# EAGLE design cg2 (EAGLE 4.16)
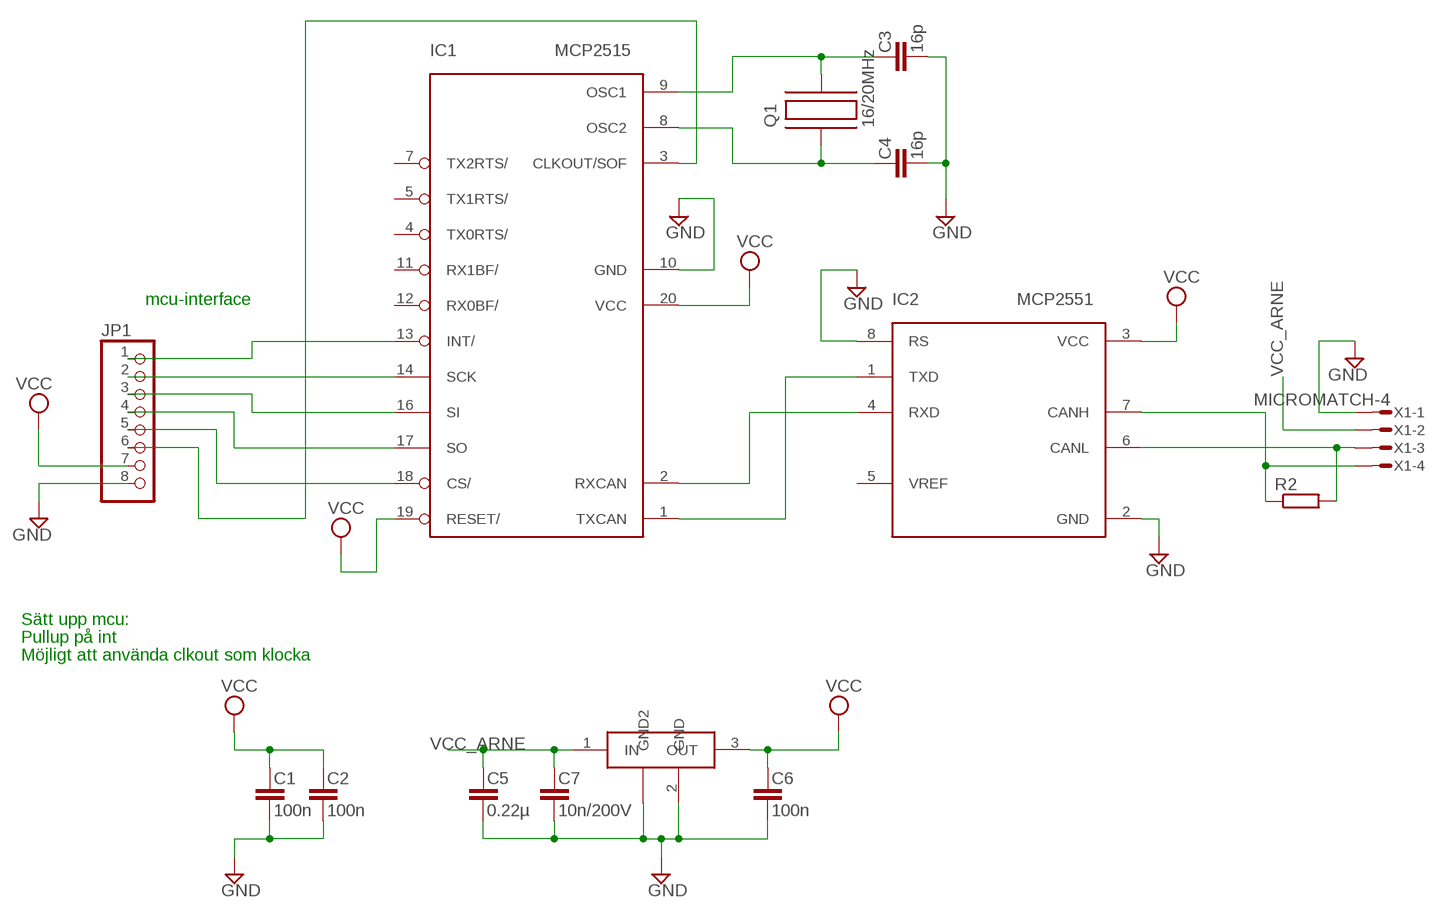
[diagram p0: schematic, sheet 1]

## Parts
C1  100n  C-EU  [C0603]
C2  100n  C-EU  [C0603]
C3  16p  C-EU  [C0603]
C4  16p  C-EU  [C0603]
C5  0.22µ  C-EU  [C0603]
C6  100n  C-EU  [C0603]
C7  10n/200V  C-EU  [C0603]
IC1  MCP2515  [TSSOP]
IC2  MCP2551  [SOIC]
IC3  LM340MP-5.0  [SOT223]
JP1  PINHD-2X04  [2X04]
Q1  16/20MHz  C-MAC-LFA147E  [SMD]
R2  R-EUR0603  [R0603]
X1  MICROMATCH-4  [MICROMATCH-4]

## Nets
CANH: IC2.7(CANH) R2.1 X1.4
CANL: IC2.6(CANL) R2.2 X1.3
CLK: IC1.3(CLKOUT/SOF) JP1.6
CS: IC1.18(CS/) JP1.5
GND: C1.2 C2.2 C3.2 C4.2 C5.2 C6.2 C7.2 IC1.10(GND) IC2.2(GND) IC2.8(RS) IC3.2(GND) IC3.4(GND2) JP1.8 X1.1
INT: IC1.13(INT/) JP1.1
N$1: IC1.2(RXCAN) IC2.4(RXD)
N$2: IC1.1(TXCAN) IC2.1(TXD)
N$12: C3.1 IC1.9(OSC1) Q1.P$2
N$13: C4.1 IC1.8(OSC2) Q1.P$1
SCK: IC1.14(SCK) JP1.2
SI: IC1.16(SI) JP1.3
SO: IC1.17(SO) JP1.4
VCC: C1.1 C2.1 C6.1 IC1.19(RESET/) IC1.20(VCC) IC2.3(VCC) IC3.3(OUT) JP1.7
VCC_ARNE: C5.1 C7.1 IC3.1(IN) X1.2
Unconnected: IC1.4(TX0RTS/) IC1.5(TX1RTS/) IC1.7(TX2RTS/) IC1.11(RX1BF/) IC1.12(RX0BF/) IC2.5(VREF)

## Notes on the sheet
- mcu-interface
- Sätt upp mcu:
- Pullup på int
- Möjligt att använda clkout som klocka

## Library data of the parts
C1-C7 = rcl:C-EU
IC1 = mcp2515:MCP2515
IC2 = mcp2551:MCP2551
IC3 = lm340mp:LM340MP-5.0
JP1 = pinhead-mm:PINHD-2X04
Q1 = hc49-4h-smx:C-MAC-LFA147E
R2 = rcl:R-EU
X1 = con-amp-micromatch:MICROMATCH-4: MicroMaTch 4 7-215464-4 / 0-215464-4 Drawing Number C-215464 DDEController.pdf

## Board
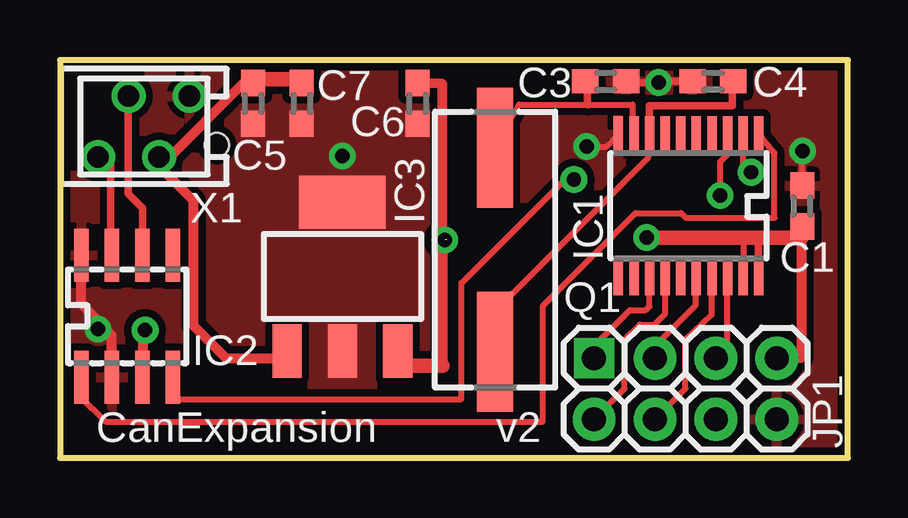
[diagram p1: board, top side]
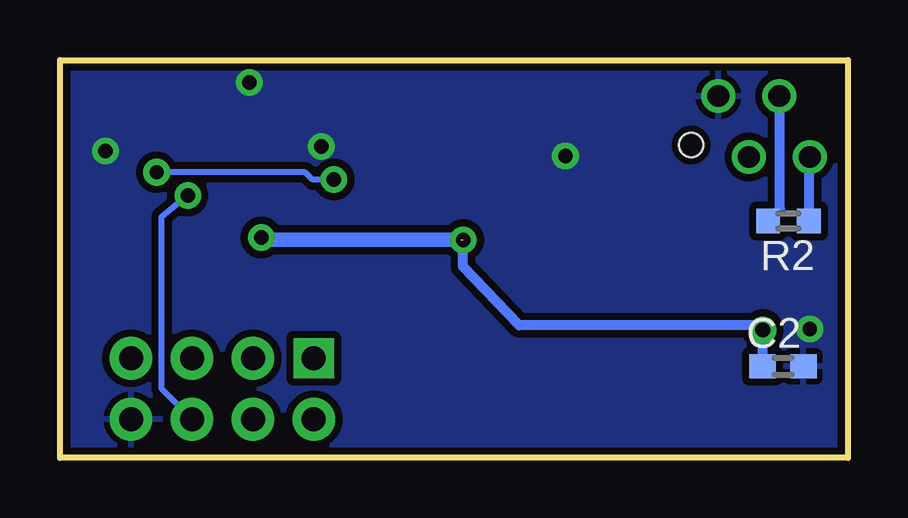
[diagram p2: board, bottom side, seen from below]

Size 32.85 x 16.58 mm. Coordinates in mm from the lower left corner, seen from the top.
Outline: 0,0 32.85,0 32.85,16.58 0,16.58 0,0
Copper layers (1*16): Top 0.035mm / dielectric 1.5mm / Bottom 0.035mm
Design rules "10mils": minimum track width 10mil, minimum drill 0.6mm, track to track 10mil, track to pad 10mil, pad to pad 10mil, via to via 10mil, smd to smd 10mil, copper to edge 10mil, drill to drill 10mil, minimum pad ring 10mil, minimum via ring 10mil, stop-mask expansion 0mil, vias tented up to drill 0mil, thermal gap 10mil

### Footprints (pad centres in the part's own frame; a part is rotated, then mirrored left to right if it is on the bottom)
C0603 = smd 1.1 x 1: 1 -0.85,0; 2 0.85,0
TSSOP = smd 0.396 x 1.5: 1 -2.925,-2.975; 2 -2.275,-2.975; 3 -1.625,-2.975; 4 -0.975,-2.975; 5 -0.325,-2.975; 6 0.325,-2.975; 7 0.975,-2.975; 8 1.625,-2.975; 9 2.275,-2.975; 10 2.925,-2.975; 11 2.925,2.975; 12 2.275,2.975; 13 1.625,2.975; 14 0.975,2.975; 15 0.325,2.975; 16 -0.325,2.975; 17 -0.975,2.975; 18 -1.625,2.975; 19 -2.275,2.975; 20 -2.925,2.975
SOIC = smd 0.6 x 2.2: 1 -1.905,-2.54; 2 -0.635,-2.54; 3 0.635,-2.54; 4 1.905,-2.54; 5 1.905,2.54; 6 0.635,2.54; 7 -0.635,2.54; 8 -1.905,2.54
SOT223 = smd 1.219 x 2.235: 1 -2.311,-3.099; 2 0,-3.099; 3 2.311,-3.099 | smd 3.6 x 2.2: 4 0,3.099
2X04 = drill 1 pad 1.676 square: 1 -3.81,1.27 | drill 1 pad 1.778 round: 2 -3.81,-1.27; 3 -1.27,1.27; 4 -1.27,-1.27; 5 1.27,1.27; 6 1.27,-1.27; 7 3.81,1.27; 8 3.81,-1.27
SMD = smd 5 x 1.5: P$1 4.25,0; P$2 -4.25,0
R0603 = smd 0.991 x 1.016: 1 -0.85,0; 2 0.85,0
MICROMATCH-4 = drill 0.9 round: 1 1.905,1.27; 2 0.635,-1.27; 3 -0.635,1.27; 4 -1.905,-1.27 | hole 1: 3.048,-0.762

### Placement (x,y rotation side)
C1  30.95,10.49 90 top
C2  2.7,3.81 0 bottom
C3  22.75,15.68 0 top
C4  27.22,15.68 180 top
C5  8.04,14.77 270 top
C6  14.9,14.77 270 top
C7  10.07,14.77 270 top
IC1  26.21,10.51 180 top
IC2  2.8,5.9 0 top
IC3  11.78,7.56 0 top
JP1  26.08,2.88 0 top
Q1  18.14,8.68 270 top
R2  2.48,9.87 180 bottom
X1  3.5,13.8 0 top

### Tracks (layer width: path | path; a pad name or v marks a point on that pad's centre or on a via)
CANH
  Top 0.305: IC2.7 2.12,8.44 2.12,12.53 X1.4
  Bottom 0.406: X1.4 1.62,12.53 1.62,9.88 R2.1
CANL
  Top 0.305: X1.3 2.84,15.07 2.84,11.01 3.45,10.4 IC2.6
  Bottom 0.406: R2.2 2.84,10.36 2.84,15.1 | 2.84,15.1 2.84,15.18 | 2.84,15.1 X1.3
CLK  (via drill 0.6)
  Top 0.254: v27.53,10.93 27.53,12.33 27.83,12.64 IC1.3
  Bottom 0.254: v27.53,10.93 28.62,10.05 28.62,2.88 JP1.6
CS
  Top 0.254: IC1.18 27.83,7.66 27.83,4.63 JP1.5
GND  (via drill 0.6)
  Top 0.254: v21.96,12.97 22.77,12.97 IC1.10 | v30.95,12.79 30.95,11.92 C1.2 | 1.79,5.47 v1.59,5.37
  Top 0.305: IC2.2 2.15,4.3 | C3.2 24.08,15.63 v24.96,15.63 25.04,15.73 25.09,15.68 C4.2
  Top 0.406: 2.15,4.3 2.15,5.12 1.79,5.47 0.88,6.41 0.88,7.66 0.83,8.42 IC2.8
  Bottom 0.305: v24.96,15.63 25.01,15.79
  other vias: 11.78,12.58
  pour Bottom (isolate 0.305): 0.12,16.47 32.83,16.47 32.83,0.1 24.38,0.1 0.12,0.1
  pour Top (isolate 0.305, no thermals): 6.11,15.98 15.77,15.98 15.77,2.9 6.11,2.9
  pour Top (isolate 0.305): 0.17,16.42 32.68,16.42 32.68,0.11 0.17,0.11
INT
  Top 0.254: IC1.13 24.58,6.31 24.43,6.16 23.77,6.16 22.27,4.66 JP1.1
N$1  (via drill 0.6)
  Top 0.254: v21.43,11.59 21.05,11.59 16.73,7.28 16.73,2.45 4.94,2.45 IC2.4 | v28.82,11.9 28.49,12.23 28.49,13.09 28.44,13.14 IC1.2
  Bottom 0.254: v21.43,11.59 22.32,11.59 22.62,11.9 v28.82,11.9
N$2
  Top 0.254: IC2.1 0.83,2.58 1.9,1.51 20.13,1.51 20.13,6.34 23.99,10.2 25.9,10.2 26.1,9.99 29.79,9.99 29.79,12.7 IC1.1
N$12
  Top 0.254: IC1.9 23.87,14.13 23.87,14.72 21.99,14.72 19.14,14.72 Q1.P$2
  Top 0.305: C3.1 21.99,15.42 21.99,14.72
N$13
  Top 0.254: IC1.8 24.53,12.86 24.53,12.51 18.15,6.13 Q1.P$1
  Top 0.305: IC1.8 24.58,14.67 28.03,14.67 28.03,15.48 28.07,15.52 C4.1
SCK
  Top 0.254: IC1.14 25.23,7.62 25.19,7.58 IC1.14 25.24,6.01 24.78,5.55 24.17,5.55 23.54,4.91 23.54,2.88 | JP1.2 23.54,2.88 | 23.54,2.88 23.55,2.89
SI
  Top 0.254: IC1.16 26.53,7.65 26.51,7.63 26.51,6.36 24.81,4.66 JP1.3
SO
  Top 0.254: IC1.17 27.18,7.59 27.17,7.58 27.17,5.96 26.08,4.91 26.08,2.88 | JP1.4 26.08,2.88 | 26.08,2.88 26.09,2.89
VCC  (via drill 0.6, 0.61)  (1 unrouted)
  Top 0.254: IC1.20 29.13,7.65 | 28.49,9.11 28.49,9.18 28.49,7.66
  Top 0.305: IC1.20 29.12,7.66 29.12,9.08 29.68,9.18 | 28.49,7.66 IC1.19
  Top 0.406: C6.1 15.95,15.58 15.95,8.88 | 15.95,3.84 15.95,8.67 15.95,8.88 | 14.08,3.84 14.08,4.66 IC3.3 | 29.68,9.18 | JP1.7 30.9,4.15 30.9,9.18 | IC2.3 3.45,5.32 v3.55,5.32 | 15.95,8.88 15.94,8.88 15.94,8.98 v16.04,9.08
  Top 0.61: 15.95,3.84 14.08,3.84 | v24.45,9.18 28.49,9.18 29.68,9.18 | C1.1 30.9,9.74 30.9,9.18 29.68,9.18
  Bottom 0.406: 24.3,9.08 v24.45,9.18 | C2.1 3.55,5.22 3.85,5.52 13.71,5.52 16.04,7.96 v16.04,9.08 | C2.1 | C2.1 v3.55,5.32 | 16.15,9.08 16.15,8.98
  Bottom 0.61: 16.15,9.08 24.3,9.08
VCC_ARNE
  Top 0.305: IC3.1 9.44,4.4 9.44,4.15
  Top 0.406: 9.44,4.15 6.92,4.15 5.58,5.5 5.58,10.71 4.16,12.13 4.16,12.51 X1.2 4.56,12.53 7.61,15.58 8.02,15.58 8.02,15.59 C5.1
  Top 0.61: C7.1 9.95,15.79 8.55,15.79 C5.1

### Text on the board
tPlace: CanExpansion | v2